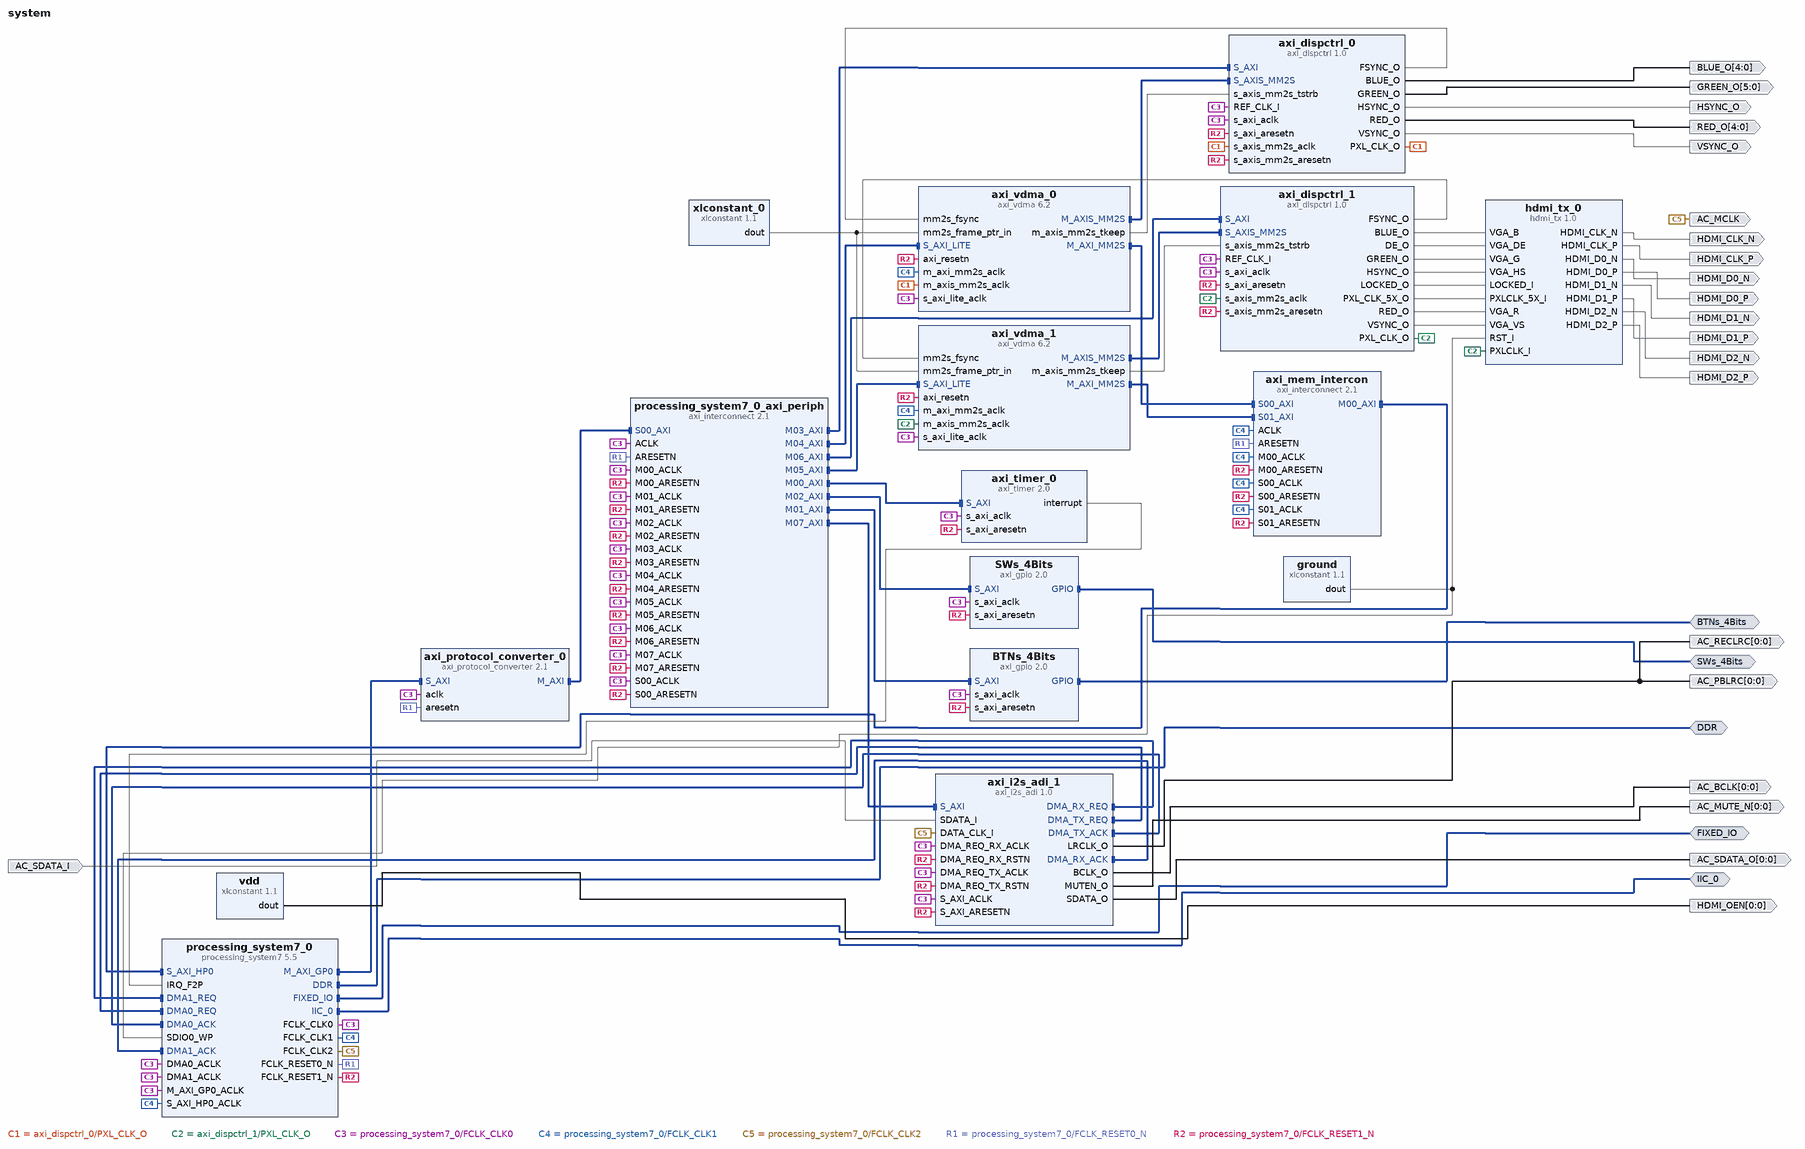
[diagram p0: block diagram of the top level]
# Vivado block design system, Vivado 2016.2
create_bd_design system

create_bd_intf_port -mode Master -vlnv xilinx.com:interface:gpio_rtl:1.0 BTNs_4Bits
create_bd_intf_port -mode Master -vlnv xilinx.com:interface:ddrx_rtl:1.0 DDR
create_bd_intf_port -mode Master -vlnv xilinx.com:display_processing_system7:fixedio_rtl:1.0 FIXED_IO
create_bd_intf_port -mode Master -vlnv xilinx.com:interface:iic_rtl:1.0 IIC_0
create_bd_intf_port -mode Master -vlnv xilinx.com:interface:gpio_rtl:1.0 SWs_4Bits
create_bd_port -dir I AC_SDATA_I
create_bd_port -dir O -from 4 -to 0 BLUE_O
create_bd_port -dir O -from 5 -to 0 GREEN_O
create_bd_port -dir O HSYNC_O
create_bd_port -dir O -from 4 -to 0 RED_O
create_bd_port -dir O VSYNC_O
create_bd_port -dir O -from 0 -to 0 AC_BCLK
create_bd_port -dir O -from 0 -to 0 AC_PBLRC
create_bd_port -dir O -from 0 -to 0 AC_RECLRC
create_bd_port -dir O -from 0 -to 0 AC_MUTE_N
create_bd_port -dir O -from 0 -to 0 AC_SDATA_O
create_bd_port -dir O HDMI_CLK_N
create_bd_port -dir O HDMI_CLK_P
create_bd_port -dir O HDMI_D0_N
create_bd_port -dir O HDMI_D0_P
create_bd_port -dir O HDMI_D1_N
create_bd_port -dir O HDMI_D1_P
create_bd_port -dir O HDMI_D2_N
create_bd_port -dir O HDMI_D2_P
create_bd_port -dir O AC_MCLK
create_bd_port -dir O -from 0 -to 0 HDMI_OEN

create_bd_cell -type ip -vlnv Digilent:digilent:axi_dispctrl:1.0 axi_dispctrl_0
set_property -dict {CONFIG.C_BLUE_WIDTH 5 CONFIG.C_GREEN_WIDTH 6 CONFIG.C_RED_WIDTH 5} [get_bd_cells axi_dispctrl_0]
create_bd_cell -type ip -vlnv Digilent:digilent:axi_dispctrl:1.0 axi_dispctrl_1
set_property -dict {CONFIG.C_USE_BUFR_DIV5 1} [get_bd_cells axi_dispctrl_1]
create_bd_cell -type ip -vlnv analogdeviceinc.com:adi:axi_i2s_adi:1.0 axi_i2s_adi_1
set_property -dict {CONFIG.C_DMA_TYPE 1} [get_bd_cells axi_i2s_adi_1]
create_bd_cell -type ip -vlnv digilentinc.com:digilent:hdmi_tx:1.0 hdmi_tx_0
set_property -dict {CONFIG.C_BLUE_WIDTH 8 CONFIG.C_GREEN_WIDTH 8 CONFIG.C_RED_WIDTH 8} [get_bd_cells hdmi_tx_0]
create_bd_cell -type ip -vlnv xilinx.com:ip:axi_gpio:2.0 BTNs_4Bits
set_property -dict {CONFIG.C_GPIO_WIDTH 4 CONFIG.C_ALL_INPUTS 1} [get_bd_cells BTNs_4Bits]
create_bd_cell -type ip -vlnv xilinx.com:ip:axi_gpio:2.0 SWs_4Bits
set_property -dict {CONFIG.C_GPIO_WIDTH 4 CONFIG.C_ALL_INPUTS 1} [get_bd_cells SWs_4Bits]
create_bd_cell -type ip -vlnv xilinx.com:ip:axi_interconnect:2.1 axi_mem_intercon
set_property -dict {CONFIG.NUM_SI 2 CONFIG.NUM_MI 1 CONFIG.ENABLE_ADVANCED_OPTIONS 0} [get_bd_cells axi_mem_intercon]
create_bd_cell -type ip -vlnv xilinx.com:ip:axi_protocol_converter:2.1 axi_protocol_converter_0
set_property -dict {CONFIG.MI_PROTOCOL AXI4LITE} [get_bd_cells axi_protocol_converter_0]
create_bd_cell -type ip -vlnv xilinx.com:ip:axi_vdma:6.2 axi_vdma_0
set_property -dict [list \
  CONFIG.c_m_axi_mm2s_data_width 64 \
  CONFIG.c_use_mm2s_fsync 1 \
  CONFIG.c_mm2s_genlock_mode 1 \
  CONFIG.c_mm2s_linebuffer_depth 2048 \
  CONFIG.c_mm2s_max_burst_length 16 \
  CONFIG.c_include_s2mm 0 \
  CONFIG.c_enable_debug_all 1 \
] [get_bd_cells axi_vdma_0]
create_bd_cell -type ip -vlnv xilinx.com:ip:axi_vdma:6.2 axi_vdma_1
set_property -dict [list \
  CONFIG.c_m_axi_mm2s_data_width 64 \
  CONFIG.c_use_mm2s_fsync 1 \
  CONFIG.c_mm2s_genlock_mode 1 \
  CONFIG.c_mm2s_linebuffer_depth 2048 \
  CONFIG.c_mm2s_max_burst_length 16 \
  CONFIG.c_include_s2mm 0 \
  CONFIG.c_enable_debug_all 1 \
] [get_bd_cells axi_vdma_1]
create_bd_cell -type ip -vlnv xilinx.com:ip:xlconstant:1.1 ground
set_property -dict {CONFIG.CONST_VAL 0} [get_bd_cells ground]
create_bd_cell -type ip -vlnv xilinx.com:ip:processing_system7:5.5 processing_system7_0
set_property -dict [list \
  CONFIG.PCW_FPGA1_PERIPHERAL_FREQMHZ 150 \
  CONFIG.PCW_FPGA2_PERIPHERAL_FREQMHZ 12.288 \
  CONFIG.PCW_USE_S_AXI_HP0 1 \
  CONFIG.PCW_USE_DMA0 1 \
  CONFIG.PCW_USE_DMA1 1 \
  CONFIG.PCW_USE_FABRIC_INTERRUPT 1 \
  CONFIG.PCW_EN_CLK1_PORT 1 \
  CONFIG.PCW_EN_CLK2_PORT 1 \
  CONFIG.PCW_EN_RST1_PORT 1 \
  CONFIG.PCW_IRQ_F2P_INTR 1 \
  CONFIG.PCW_IMPORT_BOARD_PRESET ./lib/xml/ZYBO_zynq_def.xml \
  CONFIG.PCW_SD0_GRP_WP_ENABLE 1 \
  CONFIG.PCW_I2C0_PERIPHERAL_ENABLE 1 \
  CONFIG.PCW_FCLK1_PERIPHERAL_CLKSRC {DDR PLL} \
  CONFIG.PCW_FCLK2_PERIPHERAL_CLKSRC {ARM PLL} \
] [get_bd_cells processing_system7_0]
# 2 more settings of processing_system7_0 are not shown: defaults, MIO pin electricals, DDR timing, and values the tool derives
create_bd_cell -type ip -vlnv xilinx.com:ip:axi_interconnect:2.1 processing_system7_0_axi_periph
set_property -dict [list \
  CONFIG.NUM_MI 8 \
  CONFIG.STRATEGY 1 \
  CONFIG.ENABLE_ADVANCED_OPTIONS 0 \
  CONFIG.M00_HAS_REGSLICE 4 \
  CONFIG.M01_HAS_REGSLICE 4 \
  CONFIG.M02_HAS_REGSLICE 4 \
  CONFIG.M03_HAS_REGSLICE 4 \
  CONFIG.M04_HAS_REGSLICE 4 \
  CONFIG.M05_HAS_REGSLICE 4 \
  CONFIG.M06_HAS_REGSLICE 4 \
  CONFIG.M07_HAS_REGSLICE 4 \
] [get_bd_cells processing_system7_0_axi_periph]
create_bd_cell -type ip -vlnv xilinx.com:ip:xlconstant:1.1 vdd
create_bd_cell -type ip -vlnv xilinx.com:ip:xlconstant:1.1 xlconstant_0
set_property -dict {CONFIG.CONST_WIDTH 6 CONFIG.CONST_VAL 0} [get_bd_cells xlconstant_0]
create_bd_cell -type ip -vlnv xilinx.com:ip:axi_timer:2.0 axi_timer_0

# ---- connections ----

connect_bd_intf_net [get_bd_intf_pins axi_i2s_adi_1/DMA_RX_REQ] [get_bd_intf_pins processing_system7_0/DMA1_REQ]
connect_bd_intf_net [get_bd_intf_pins axi_i2s_adi_1/DMA_TX_REQ] [get_bd_intf_pins processing_system7_0/DMA0_REQ]
connect_bd_intf_net [get_bd_intf_pins axi_mem_intercon/M00_AXI] [get_bd_intf_pins processing_system7_0/S_AXI_HP0]
connect_bd_intf_net [get_bd_intf_pins axi_dispctrl_0/S_AXIS_MM2S] [get_bd_intf_pins axi_vdma_0/M_AXIS_MM2S]
connect_bd_intf_net [get_bd_intf_pins axi_mem_intercon/S00_AXI] [get_bd_intf_pins axi_vdma_0/M_AXI_MM2S]
connect_bd_intf_net [get_bd_intf_pins axi_dispctrl_1/S_AXIS_MM2S] [get_bd_intf_pins axi_vdma_1/M_AXIS_MM2S]
connect_bd_intf_net [get_bd_intf_pins axi_i2s_adi_1/DMA_TX_ACK] [get_bd_intf_pins processing_system7_0/DMA0_ACK]
connect_bd_intf_net [get_bd_intf_pins axi_i2s_adi_1/DMA_RX_ACK] [get_bd_intf_pins processing_system7_0/DMA1_ACK]
connect_bd_intf_net -intf_net processing_system7_0_M_AXI_GP0 [get_bd_intf_pins axi_protocol_converter_0/M_AXI] [get_bd_intf_pins processing_system7_0_axi_periph/S00_AXI]
connect_bd_intf_net [get_bd_intf_pins axi_protocol_converter_0/S_AXI] [get_bd_intf_pins processing_system7_0/M_AXI_GP0]
connect_bd_intf_net [get_bd_intf_pins BTNs_4Bits/S_AXI] [get_bd_intf_pins processing_system7_0_axi_periph/M01_AXI]
connect_bd_intf_net [get_bd_intf_pins SWs_4Bits/S_AXI] [get_bd_intf_pins processing_system7_0_axi_periph/M02_AXI]
connect_bd_intf_net [get_bd_intf_pins axi_dispctrl_0/S_AXI] [get_bd_intf_pins processing_system7_0_axi_periph/M03_AXI]
connect_bd_intf_net [get_bd_intf_pins axi_vdma_0/S_AXI_LITE] [get_bd_intf_pins processing_system7_0_axi_periph/M04_AXI]
connect_bd_intf_net [get_bd_intf_pins axi_vdma_1/S_AXI_LITE] [get_bd_intf_pins processing_system7_0_axi_periph/M05_AXI]
connect_bd_intf_net [get_bd_intf_pins axi_dispctrl_1/S_AXI] [get_bd_intf_pins processing_system7_0_axi_periph/M06_AXI]
connect_bd_intf_net [get_bd_intf_pins axi_i2s_adi_1/S_AXI] [get_bd_intf_pins processing_system7_0_axi_periph/M07_AXI]
connect_bd_intf_net [get_bd_intf_pins axi_mem_intercon/S01_AXI] [get_bd_intf_pins axi_vdma_1/M_AXI_MM2S]
connect_bd_intf_net [get_bd_intf_pins processing_system7_0_axi_periph/M00_AXI] [get_bd_intf_pins axi_timer_0/S_AXI]
connect_bd_intf_net [get_bd_intf_ports BTNs_4Bits] [get_bd_intf_pins BTNs_4Bits/GPIO]
connect_bd_intf_net [get_bd_intf_ports DDR] [get_bd_intf_pins processing_system7_0/DDR]
connect_bd_intf_net [get_bd_intf_ports FIXED_IO] [get_bd_intf_pins processing_system7_0/FIXED_IO]
connect_bd_intf_net [get_bd_intf_ports IIC_0] [get_bd_intf_pins processing_system7_0/IIC_0]
connect_bd_intf_net [get_bd_intf_ports SWs_4Bits] [get_bd_intf_pins SWs_4Bits/GPIO]
connect_bd_net [get_bd_ports AC_SDATA_I] [get_bd_pins axi_i2s_adi_1/SDATA_I]
connect_bd_net [get_bd_pins axi_dispctrl_0/BLUE_O] [get_bd_ports BLUE_O]
connect_bd_net [get_bd_pins axi_dispctrl_0/FSYNC_O] [get_bd_pins axi_vdma_0/mm2s_fsync]
connect_bd_net [get_bd_pins axi_dispctrl_0/GREEN_O] [get_bd_ports GREEN_O]
connect_bd_net [get_bd_pins axi_dispctrl_0/HSYNC_O] [get_bd_ports HSYNC_O]
connect_bd_net [get_bd_pins axi_dispctrl_0/PXL_CLK_O] [get_bd_pins axi_dispctrl_0/s_axis_mm2s_aclk] [get_bd_pins axi_vdma_0/m_axis_mm2s_aclk]
connect_bd_net [get_bd_pins axi_dispctrl_0/RED_O] [get_bd_ports RED_O]
connect_bd_net [get_bd_pins axi_dispctrl_0/VSYNC_O] [get_bd_ports VSYNC_O]
connect_bd_net [get_bd_pins axi_dispctrl_1/BLUE_O] [get_bd_pins hdmi_tx_0/VGA_B]
connect_bd_net [get_bd_pins axi_dispctrl_1/DE_O] [get_bd_pins hdmi_tx_0/VGA_DE]
connect_bd_net [get_bd_pins axi_dispctrl_1/FSYNC_O] [get_bd_pins axi_vdma_1/mm2s_fsync]
connect_bd_net [get_bd_pins axi_dispctrl_1/GREEN_O] [get_bd_pins hdmi_tx_0/VGA_G]
connect_bd_net [get_bd_pins axi_dispctrl_1/HSYNC_O] [get_bd_pins hdmi_tx_0/VGA_HS]
connect_bd_net [get_bd_pins axi_dispctrl_1/LOCKED_O] [get_bd_pins hdmi_tx_0/LOCKED_I]
connect_bd_net [get_bd_pins axi_dispctrl_1/PXL_CLK_5X_O] [get_bd_pins hdmi_tx_0/PXLCLK_5X_I]
connect_bd_net [get_bd_pins axi_dispctrl_1/PXL_CLK_O] \
  [get_bd_pins axi_dispctrl_1/s_axis_mm2s_aclk] [get_bd_pins hdmi_tx_0/PXLCLK_I] [get_bd_pins axi_vdma_1/m_axis_mm2s_aclk]
connect_bd_net [get_bd_pins axi_dispctrl_1/RED_O] [get_bd_pins hdmi_tx_0/VGA_R]
connect_bd_net [get_bd_pins axi_dispctrl_1/VSYNC_O] [get_bd_pins hdmi_tx_0/VGA_VS]
connect_bd_net [get_bd_pins axi_i2s_adi_1/BCLK_O] [get_bd_ports AC_BCLK]
connect_bd_net [get_bd_pins axi_i2s_adi_1/LRCLK_O] [get_bd_ports AC_RECLRC] [get_bd_ports AC_PBLRC]
connect_bd_net [get_bd_pins axi_i2s_adi_1/MUTEN_O] [get_bd_ports AC_MUTE_N]
connect_bd_net [get_bd_pins axi_i2s_adi_1/SDATA_O] [get_bd_ports AC_SDATA_O]
connect_bd_net [get_bd_pins axi_vdma_0/m_axis_mm2s_tkeep] [get_bd_pins axi_dispctrl_0/s_axis_mm2s_tstrb]
connect_bd_net [get_bd_pins axi_vdma_1/m_axis_mm2s_tkeep] [get_bd_pins axi_dispctrl_1/s_axis_mm2s_tstrb]
connect_bd_net [get_bd_pins hdmi_tx_0/HDMI_CLK_N] [get_bd_ports HDMI_CLK_N]
connect_bd_net [get_bd_pins hdmi_tx_0/HDMI_CLK_P] [get_bd_ports HDMI_CLK_P]
connect_bd_net [get_bd_pins hdmi_tx_0/HDMI_D0_N] [get_bd_ports HDMI_D0_N]
connect_bd_net [get_bd_pins hdmi_tx_0/HDMI_D0_P] [get_bd_ports HDMI_D0_P]
connect_bd_net [get_bd_pins hdmi_tx_0/HDMI_D1_N] [get_bd_ports HDMI_D1_N]
connect_bd_net [get_bd_pins hdmi_tx_0/HDMI_D1_P] [get_bd_ports HDMI_D1_P]
connect_bd_net [get_bd_pins hdmi_tx_0/HDMI_D2_N] [get_bd_ports HDMI_D2_N]
connect_bd_net [get_bd_pins hdmi_tx_0/HDMI_D2_P] [get_bd_ports HDMI_D2_P]
connect_bd_net [get_bd_pins processing_system7_0/FCLK_CLK0] \
  [get_bd_pins axi_dispctrl_0/REF_CLK_I] [get_bd_pins axi_dispctrl_0/s_axi_aclk] [get_bd_pins axi_dispctrl_1/REF_CLK_I] \
  [get_bd_pins axi_dispctrl_1/s_axi_aclk] [get_bd_pins axi_i2s_adi_1/DMA_REQ_RX_ACLK] \
  [get_bd_pins axi_i2s_adi_1/DMA_REQ_TX_ACLK] [get_bd_pins axi_i2s_adi_1/S_AXI_ACLK] [get_bd_pins BTNs_4Bits/s_axi_aclk] \
  [get_bd_pins SWs_4Bits/s_axi_aclk] [get_bd_pins axi_protocol_converter_0/aclk] [get_bd_pins axi_vdma_0/s_axi_lite_aclk] \
  [get_bd_pins axi_vdma_1/s_axi_lite_aclk] [get_bd_pins processing_system7_0/M_AXI_GP0_ACLK] \
  [get_bd_pins processing_system7_0/DMA0_ACLK] [get_bd_pins processing_system7_0/DMA1_ACLK] \
  [get_bd_pins axi_timer_0/s_axi_aclk] [get_bd_pins processing_system7_0_axi_periph/ACLK] \
  [get_bd_pins processing_system7_0_axi_periph/S00_ACLK] [get_bd_pins processing_system7_0_axi_periph/M00_ACLK] \
  [get_bd_pins processing_system7_0_axi_periph/M01_ACLK] [get_bd_pins processing_system7_0_axi_periph/M02_ACLK] \
  [get_bd_pins processing_system7_0_axi_periph/M03_ACLK] [get_bd_pins processing_system7_0_axi_periph/M04_ACLK] \
  [get_bd_pins processing_system7_0_axi_periph/M05_ACLK] [get_bd_pins processing_system7_0_axi_periph/M06_ACLK] \
  [get_bd_pins processing_system7_0_axi_periph/M07_ACLK]
connect_bd_net [get_bd_pins processing_system7_0/FCLK_CLK1] \
  [get_bd_pins axi_vdma_0/m_axi_mm2s_aclk] [get_bd_pins axi_vdma_1/m_axi_mm2s_aclk] \
  [get_bd_pins processing_system7_0/S_AXI_HP0_ACLK] [get_bd_pins axi_mem_intercon/ACLK] \
  [get_bd_pins axi_mem_intercon/S00_ACLK] [get_bd_pins axi_mem_intercon/S01_ACLK] [get_bd_pins axi_mem_intercon/M00_ACLK]
connect_bd_net [get_bd_pins processing_system7_0/FCLK_CLK2] [get_bd_ports AC_MCLK] [get_bd_pins axi_i2s_adi_1/DATA_CLK_I]
connect_bd_net -net rst_processing_system7_0_97M_interconnect_aresetn [get_bd_pins processing_system7_0/FCLK_RESET0_N] \
  [get_bd_pins axi_protocol_converter_0/aresetn] [get_bd_pins axi_mem_intercon/ARESETN] \
  [get_bd_pins processing_system7_0_axi_periph/ARESETN]
connect_bd_net -net rst_processing_system7_0_97M_peripheral_aresetn [get_bd_pins processing_system7_0/FCLK_RESET1_N] \
  [get_bd_pins axi_dispctrl_0/s_axi_aresetn] [get_bd_pins axi_dispctrl_0/s_axis_mm2s_aresetn] \
  [get_bd_pins axi_dispctrl_1/s_axi_aresetn] [get_bd_pins axi_dispctrl_1/s_axis_mm2s_aresetn] \
  [get_bd_pins axi_i2s_adi_1/DMA_REQ_RX_RSTN] [get_bd_pins axi_i2s_adi_1/DMA_REQ_TX_RSTN] \
  [get_bd_pins axi_i2s_adi_1/S_AXI_ARESETN] [get_bd_pins BTNs_4Bits/s_axi_aresetn] [get_bd_pins SWs_4Bits/s_axi_aresetn] \
  [get_bd_pins axi_vdma_0/axi_resetn] [get_bd_pins axi_vdma_1/axi_resetn] [get_bd_pins axi_timer_0/s_axi_aresetn] \
  [get_bd_pins axi_mem_intercon/S00_ARESETN] [get_bd_pins axi_mem_intercon/S01_ARESETN] \
  [get_bd_pins axi_mem_intercon/M00_ARESETN] [get_bd_pins processing_system7_0_axi_periph/S00_ARESETN] \
  [get_bd_pins processing_system7_0_axi_periph/M00_ARESETN] [get_bd_pins processing_system7_0_axi_periph/M01_ARESETN] \
  [get_bd_pins processing_system7_0_axi_periph/M02_ARESETN] [get_bd_pins processing_system7_0_axi_periph/M03_ARESETN] \
  [get_bd_pins processing_system7_0_axi_periph/M04_ARESETN] [get_bd_pins processing_system7_0_axi_periph/M05_ARESETN] \
  [get_bd_pins processing_system7_0_axi_periph/M06_ARESETN] [get_bd_pins processing_system7_0_axi_periph/M07_ARESETN]
connect_bd_net -net vdd_const [get_bd_pins vdd/dout] [get_bd_ports HDMI_OEN]
connect_bd_net -net xlconstant_0_const [get_bd_pins ground/dout] [get_bd_pins hdmi_tx_0/RST_I] [get_bd_pins processing_system7_0/SDIO0_WP]
connect_bd_net -net xlconstant_0_const1 [get_bd_pins xlconstant_0/dout] \
  [get_bd_pins axi_vdma_0/mm2s_frame_ptr_in] [get_bd_pins axi_vdma_1/mm2s_frame_ptr_in]
connect_bd_net [get_bd_pins axi_timer_0/interrupt] [get_bd_pins processing_system7_0/IRQ_F2P]

# ---- address map ----
assign_bd_address -offset 0x00000000 -range 512M -target_address_space [get_bd_addr_spaces axi_vdma_0/Data_MM2S] [get_bd_addr_segs processing_system7_0/S_AXI_HP0/HP0_DDR_LOWOCM]
assign_bd_address -offset 0x00000000 -range 512M -target_address_space [get_bd_addr_spaces axi_vdma_1/Data_MM2S] [get_bd_addr_segs processing_system7_0/S_AXI_HP0/HP0_DDR_LOWOCM]
assign_bd_address -offset 0x41200000 -range 64K -target_address_space [get_bd_addr_spaces processing_system7_0/Data] [get_bd_addr_segs BTNs_4Bits/S_AXI/Reg]
assign_bd_address -offset 0x41220000 -range 64K -target_address_space [get_bd_addr_spaces processing_system7_0/Data] [get_bd_addr_segs SWs_4Bits/S_AXI/Reg]
assign_bd_address -offset 0x42800000 -range 64K -target_address_space [get_bd_addr_spaces processing_system7_0/Data] [get_bd_addr_segs axi_timer_0/S_AXI/Reg]
assign_bd_address -offset 0x43000000 -range 64K -target_address_space [get_bd_addr_spaces processing_system7_0/Data] [get_bd_addr_segs axi_vdma_0/S_AXI_LITE/Reg]
assign_bd_address -offset 0x43010000 -range 64K -target_address_space [get_bd_addr_spaces processing_system7_0/Data] [get_bd_addr_segs axi_vdma_1/S_AXI_LITE/Reg]
assign_bd_address -offset 0x43C00000 -range 64K -target_address_space [get_bd_addr_spaces processing_system7_0/Data] [get_bd_addr_segs axi_dispctrl_0/S_AXI/S_AXI_reg]
assign_bd_address -offset 0x43C10000 -range 64K -target_address_space [get_bd_addr_spaces processing_system7_0/Data] [get_bd_addr_segs axi_dispctrl_1/S_AXI/S_AXI_reg]
assign_bd_address -offset 0x43C20000 -range 64K -target_address_space [get_bd_addr_spaces processing_system7_0/Data] [get_bd_addr_segs axi_i2s_adi_1/S_AXI/S_AXI_reg]

validate_bd_design
save_bd_design
